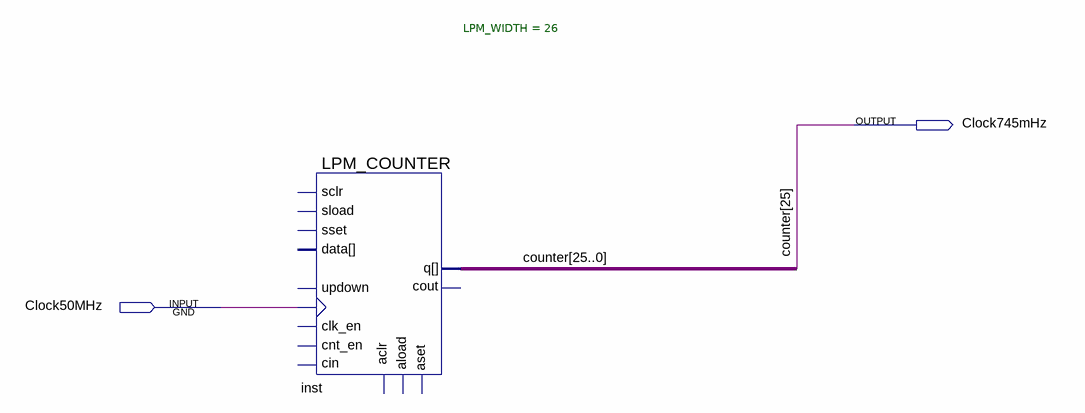
[diagram p0: schematic sheet]
// Quartus schematic ClockDivider.bdf as structural Verilog: 1 symbols, 2 pins
module ClockDivider (
  input  Clock50MHz,
  output Clock745mHz
);

  wire [24:0] counter;

  LPM_COUNTER #(.LPM_WIDTH(26)) inst (
    .clock(Clock50MHz), .q({Clock745mHz, counter}));  // open: sload, data, clk_en, aload, aclr, aset, cin, sset, updown, cnt_en, sclr, cout

  // Other names for the same wires on the sheet: counter[25] = Clock745mHz
endmodule
